# EAGLE design Domino LED No Teardrop (EAGLE 6.5.0)
DATABASE: ./../Common/BOM/Domino_DB.txt; DRAWN: M.STEMPIN; REV: D
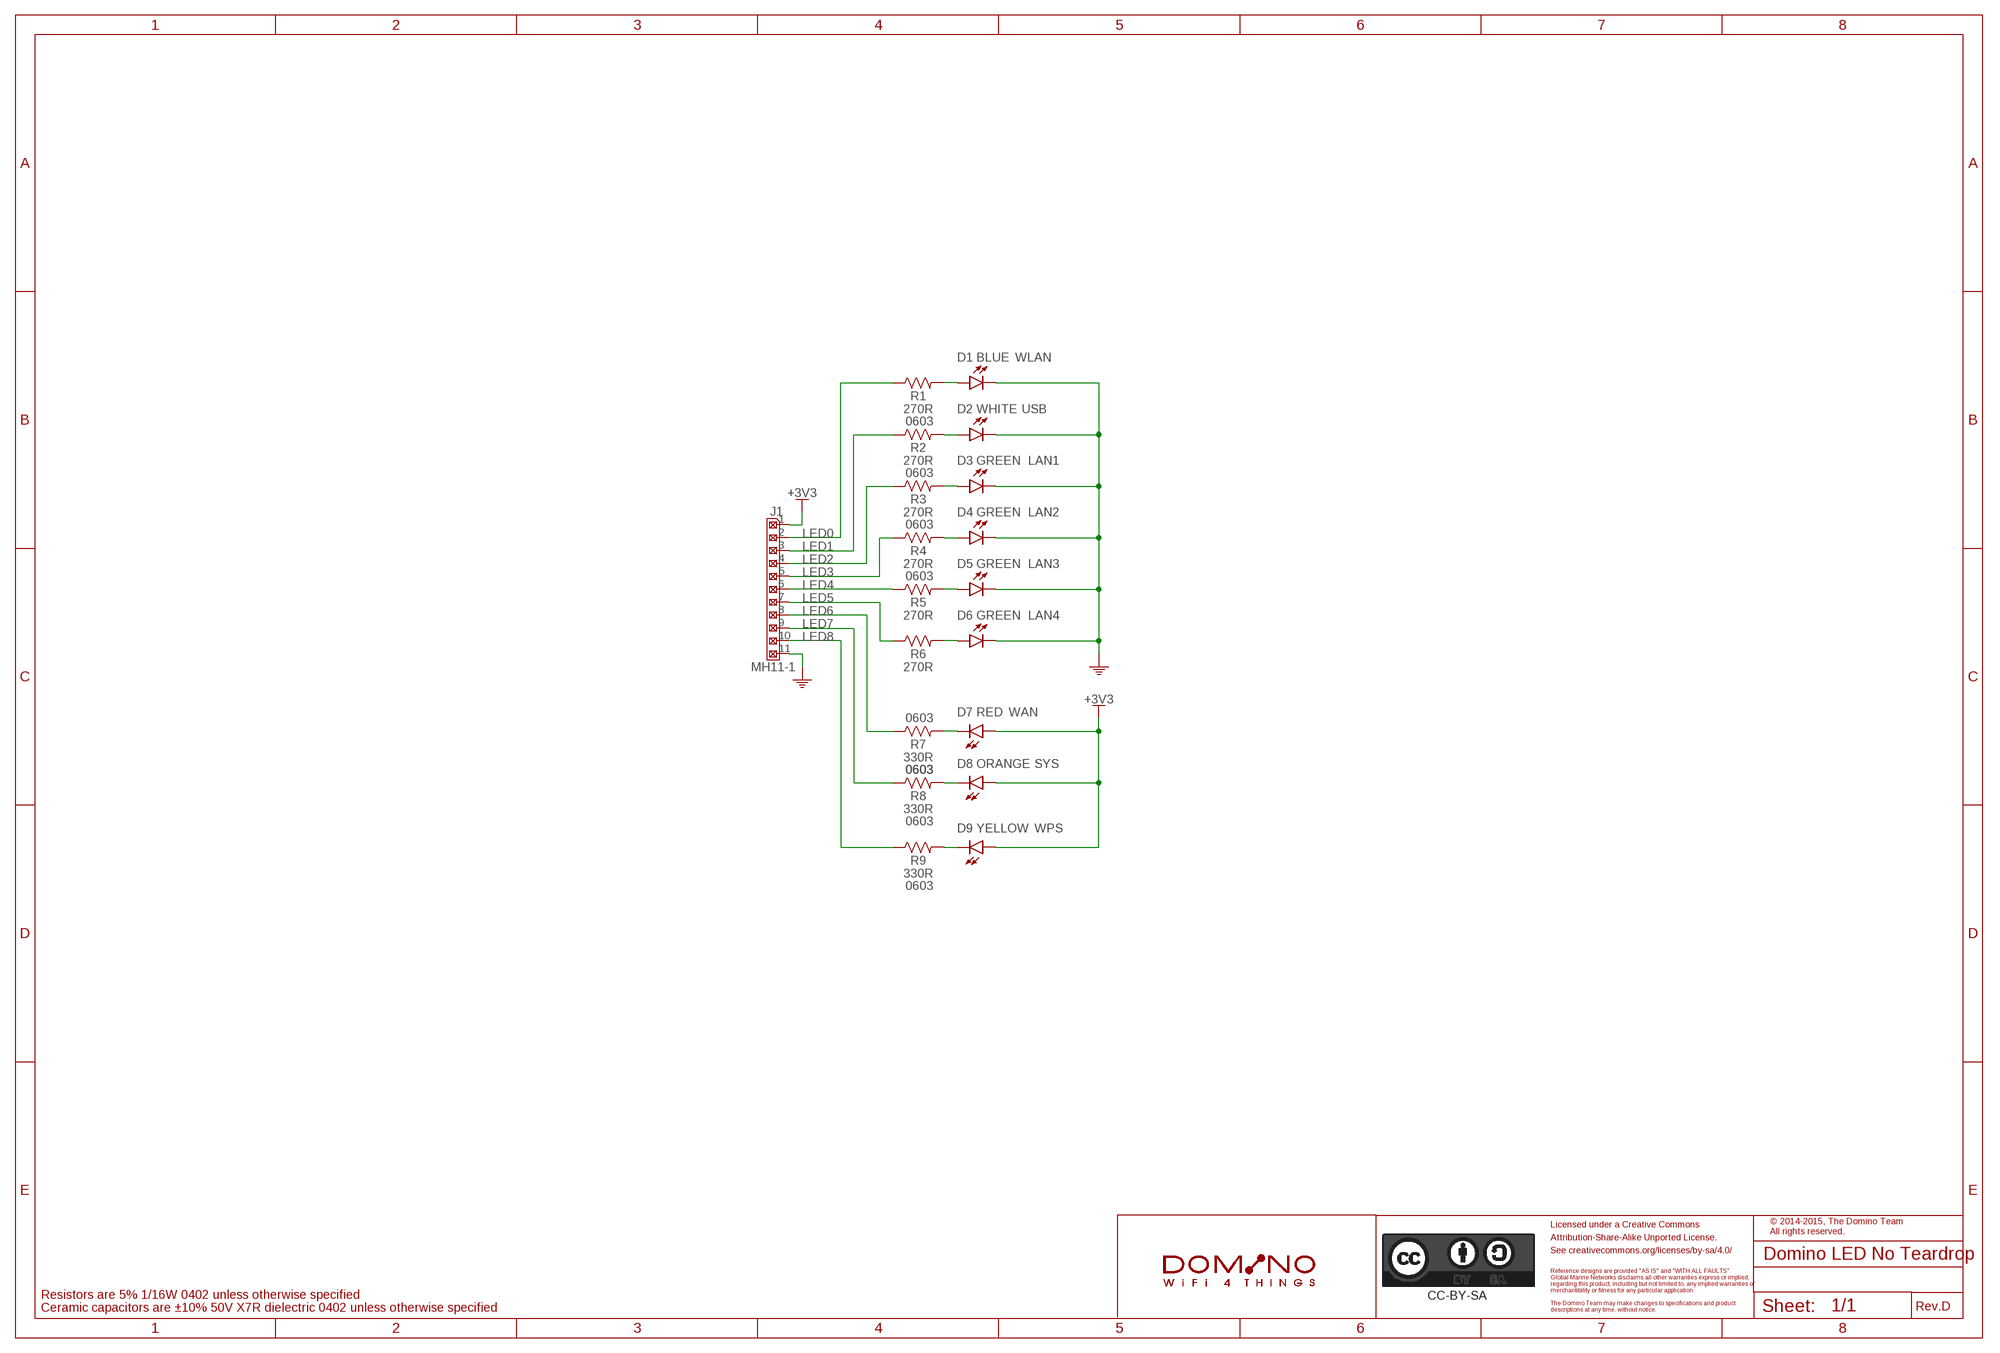
[diagram p0: schematic, sheet 1]

## Parts
CC-BY-SA1  CC-BY-SA_LOGO  [CC-BY-SA_LOGO]
D1  BLUE  LED_0603  [LED0603]
D2  WHITE  LED_0603  [LED0603]
D3  GREEN  LED_0603  [LED0603]
D4  GREEN  LED_0603  [LED0603]
D5  GREEN  LED_0603  [LED0603]
D6  GREEN  LED_0603  [LED0603]
D7  RED  LED_0603  [LED0603]
D8  ORANGE  LED_0603  [LED0603]
D9  YELLOW  LED_0603  [LED0603]
J1  MH11-1  [MH11-1-0.1]
R1  270R  RES_0603  [R0603]
R2  270R  RES_0603  [R0603]
R3  270R  RES_0603  [R0603]
R4  270R  RES_0603  [R0603]
R5  270R  RES_0603  [R0603]
R6  270R  RES_0603  [R0603]
R7  330R  RES_0603  [R0603]
R8  330R  RES_0603  [R0603]
R9  330R  RES_0603  [R0603]
U$4  DOMINO_LOGO  [DOMINO_LOGO]

## Nets
+3V3: D7.2(A) D8.2(A) D9.2(A) J1.1
GND: D1.1(C) D2.1(C) D3.1(C) D4.1(C) D5.1(C) D6.1(C) J1.11
LED0: J1.2 R1.1
LED1: J1.3 R2.1
LED2: J1.4 R3.1
LED3: J1.5 R4.1
LED4: J1.6 R5.1
LED5: J1.7 R6.1
LED6: J1.8 R7.1
LED7: J1.9 R8.1
LED8: J1.10 R9.1
N$2: D1.2(A) R1.2
N$3: D2.2(A) R2.2
N$4: D3.2(A) R3.2
N$5: D4.2(A) R4.2
N$6: D5.2(A) R5.2
N$7: D7.1(C) R7.2
N$8: D8.1(C) R8.2
N$9: D9.1(C) R9.2
N$10: D6.2(A) R6.2

## Notes on the sheet
- WLAN
- USB
- LAN1
- LAN2
- LAN3
- LAN4
- WAN
- SYS
- WPS
- Licensed under a Creative Commons
- © 2014-2015, The Domino Team
  All rights reserved.
- Attribution-Share-Alike Unported License.
- See creativecommons.org/licenses/by-sa/4.0/
- Reference designs are provided "AS IS" and "WITH ALL FAULTS".
- Global Marine Networks disclaims all other warranties express or implied,
- regarding this product, including but not limited to, any implied warranties of
- merchantibility or fitness for any particular application.
- Resistors are 5% 1/16W 0402 unless otherwise specified
- The Domino Team may make changes to specifications and product
- Ceramic capacitors are ±10% 50V X7R dielectric 0402 unless otherwise specified | descriptions at any time, without notice. | Rev.

## Library data of the parts
CC-BY-SA1 = Domino:CC-BY-SA_LOGO: Attribution-Share-Alike Unported License See creativecommons.org/licenses/by-sa/3.0/ for details.; BOM: EXCLUDE
D1 = Domino:LED_: LED; PARTNO: LED0603-BLUE
D2 = Domino:LED_: LED; PARTNO: LED0603-WHITE
D3-D6 = Domino:LED_: LED; PARTNO: LED0603-GREEN
D7 = Domino:LED_: LED; PARTNO: LED0603-RED
D8 = Domino:LED_: LED; PARTNO: LED0603-ORANGE
D9 = Domino:LED_: LED; PARTNO: LED0603-YELLOW
J1 = Domino:MH11-1: 11x1 Pin Male Header; PARTNO: MH11-1-0.1
R1-R6 = Domino:RES_: Resistor; PARTNO: R0603_270R_5%_125mW; RATE: 125mW; SIZE: 0603; TOL: 5%
R7-R9 = Domino:RES_: Resistor; PARTNO: R0603_330R_5%_125mW; RATE: 125mW; SIZE: 0603; TOL: 5%
U$4 = Domino:DOMINO_LOGO: Domino Logo; BOM: EXCLUDE

## Net classes
1 USB: width 0.254 mm, clearance 0.127 mm
2 PoE: width 0.61 mm, clearance 0.13 mm to class 0, clearance 0.13 mm to class 1, clearance 0.13 mm

## Board
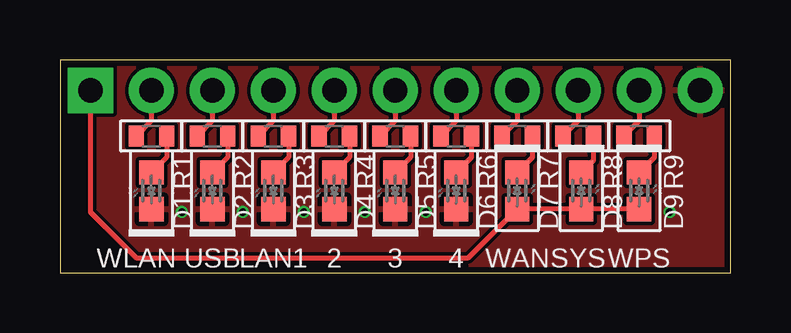
[diagram p1: board, top side]
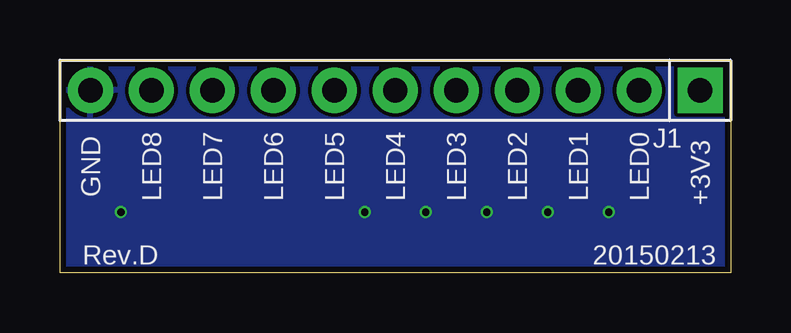
[diagram p2: board, bottom side, seen from below]

Size 27.94 x 8.89 mm. Coordinates in mm from the lower left corner, seen from the top.
Outline: 0,0 27.94,0 27.94,8.89 0,8.89 0,0
Copper layers (1*16): Top 0.043mm / dielectric 1mm / Bottom 0.043mm
Design rules "Domino": minimum track width 0.1mm, minimum drill 0.3mm, track to track 6mil, track to pad 6mil, pad to pad 6mil, via to via 6mil, smd to smd 0mil, copper to edge 0.25mm, drill to drill 0.35mm, minimum pad ring 0.085mm, minimum via ring 0.1mm, stop-mask expansion 0mil, vias tented up to drill 0.45mm, thermal gap 0.2mm

### Footprints (pad centres in the part's own frame; a part is rotated, then mirrored left to right if it is on the bottom)
LED0603 = smd 1.016 x 1.016: 1 -0.762,0; 2 0.762,0
MH11-1-0.1 = drill 1.016 pad 1.88 square: 1 0,0 | drill 1.016 pad 1.88: 2 2.54,0; 3 5.08,0; 4 7.62,0; 5 10.16,0; 6 12.7,0; 7 15.24,0; 8 17.78,0; 9 20.32,0; 10 22.86,0; 11 25.4,0
R0603 = smd 0.635 x 0.889: 1 -0.635,0; 2 0.635,0

### Placement (x,y rotation side)
CC-BY-SA1  -5.08,-50.8 0 top  (outside the outline)
D1  3.81,3.43 90 top
D2  6.35,3.43 90 top
D3  8.89,3.43 90 top
D4  11.43,3.43 90 top
D5  13.97,3.43 90 top
D6  16.51,3.43 90 top
D7  19.05,3.43 270 top
D8  21.72,3.43 270 top
D9  24.13,3.43 270 top
DRILEGEND  [DRILEGEND]  81.53,59.94 0 top  (outside the outline)
J1  1.27,7.62 180 bottom
R1  3.81,5.71 0 top
R2  6.35,5.71 0 top
R3  8.89,5.71 0 top
R4  11.43,5.71 0 top
R5  13.97,5.71 0 top
R6  16.51,5.71 0 top
R7  19.05,5.71 0 top
R8  21.59,5.71 0 top
R9  24.13,5.71 0 top
U$3  [A5L-LOC]  -55.88,-62.23 0 top  (outside the outline)
U$4  -45.72,-48.26 0 top  (outside the outline)

### Tracks (layer width: path | path; a pad name or v marks a point on that pad's centre or on a via)
+3V3
  Top 0.203: D9.2 D8.2 D7.2 17.02,0.64 3.17,0.64 1.27,2.54 J1.1
GND  (via drill 0.3 pad 0.03)
  other vias: 25.4,2.54 15.24,2.54 12.7,2.54 10.16,2.54 7.62,2.54 5.08,2.54
  pour Top: 0,8.89 27.94,8.89 27.94,0 0,0
  pour Bottom: 0,8.89 27.94,8.89 27.94,0 0,0
LED0
  Top 0.203: J1.2 3.81,6.35 R1.1
LED1
  Top 0.203: J1.3 6.35,6.35 R2.1
LED2
  Top 0.203: J1.4 8.89,6.35 R3.1
LED3
  Top 0.203: J1.5 11.43,6.35 R4.1
LED4
  Top 0.203: J1.6 13.97,6.35 R5.1
LED5
  Top 0.203: J1.7 16.51,6.35 R6.1
LED6
  Top 0.203: J1.8 19.05,6.35 R7.1
LED7
  Top 0.203: J1.9 21.59,6.35 R8.1
LED8
  Top 0.203: J1.10 24.13,6.35 R9.1
N$2
  Top 0.203: R1.2 4.45,4.83 D1.2
N$3
  Top 0.203: R2.2 6.99,4.83 D2.2
N$4
  Top 0.203: R3.2 9.53,4.83 D3.2
N$5
  Top 0.203: R4.2 12.06,4.83 D4.2
N$6
  Top 0.203: R5.2 14.61,4.83 D5.2
N$7
  Top 0.203: R7.2 19.68,4.83 D7.1
N$8
  Top 0.203: R8.2 22.23,4.7 D8.1
N$9
  Top 0.203: R9.2 24.77,4.83 D9.1
N$10
  Top 0.203: R6.2 17.14,4.83 D6.2

### Text on the board
tPlace: WLAN | USB | LAN1 | 2 | 3 | 4 | WAN | SYS | WPS
bPlace: +3V3 | LED0 | LED1 | LED2 | LED3 | LED4 | LED5 | LED6 | LED7 | LED8 | GND
bNames: Rev.
Document: DRILL CHART: TOP TO BOTTOM | STACK-UP FOR REFERENCE | LAYER 1 L1 TOP | 18 UM CU + 12.5 UM PLATING (30.5 UM) | 1.061 MM+/-10% | CORE | 1.0 MM CORE FR-4 LG 135 / INCLUDING COPPER | LAYER 4 L16 BOTTOM | 18 UM CU + 12.5 UM PLATING (30.5 UM) | NOTES: | 1. PRINTED CIRCUIT BOARD MADE FROM NEMA GRADE FR-4 TG 135 EPOXY / LAMINATE WITH 18 UM COPPER PLATING AND 1 MM THICKNESS. | 2. ALL DIMENSIONS ARE GIVEN IN MILLIMETERS EXCEPT TRACE WIDTH/SPACE. | 3. CIRCUIT PATHS ARE FOR REFERENCE ONLY. | 4. HOLE SIZES SHOWN ARE FINISHED DIAMETERS AFTER PLATING. | 5. BOARD PLATED USING REFLOW OR SIMILAR METHOD. | 6. BOARD TO HAVE WHITE SOLDER MASK ON PLATED SURFACES USING WET / FILM SR100 OR SR1010 EPOXY. / EQUIVALENT WET OR DRY FILM MAY BE USED. | 7. SILKSCREEN BOARD USING BLACK INK. DISTORTION OF SILKSCREEN / IS ACCEPTABLE OVER TRACES. EPOXY INK ON PLATED LANDS IS NOT / ACCEPTABLE | 8. THE FOLLOWING INFORMATION APPLIES TO THIS BOARD: | * 2 COPPER LAYERS | * 1 MM BOARD THICKNESS | * REQUIRES TOP AND BOTTOM SIDE SILKSCREENS | © 2014-2015, The Domino Team. / All rights reserved. | Licensed under a Creative Commons / Attribution-Share-Alike Unported License. / See creativecommons.org/licenses/by-sa/4.0/ | Reference designs are provided "AS IS" and "WITH ALL FAULTS". / The Domino Team disclaims all other warranties express or implied, / regarding this product, including but not limited to, any implied warranties of / merchantibility or fitness for any particular application. | The Domino Team may make changes to specifications and product descriptions / at any time, without notice. | Rev.
DrillLegend: LAYER-STACK
DrillLegend_01-16: 01-16
Pinout: +3V3 | LED0 | LED1 | ELD2 | LED3 | LED4 | LED5 | LED6 | LED7 | LED8 | GND | Pinout (.PIN)
Component_side: Component Side (.CMP)
Solder_side: Solder side (.SOL)
Silk_screen_CMP: Silk screen CMP (.PLC)
Silk_screen_SOL: Silk screen SOL (.PLS)
Solder_stop_mask_CMP: Solder stop mask CMP (.STC)
Solder_stop_mask_SOL: Solder stop mask SOL (.STS)
Cream_frame_CMP: Cream frame CMP (.CRC)
Cream_frame_SOL: Cream frame SOL (.CRS)
Drill_data: Drill data (.DRD)
Component_Assembly_CMP: Component Assembly CMP (.ASC)
Component_Assembly_SOL: Component Assembly SOL (.ASS)
Outline: Outline (.OLN)